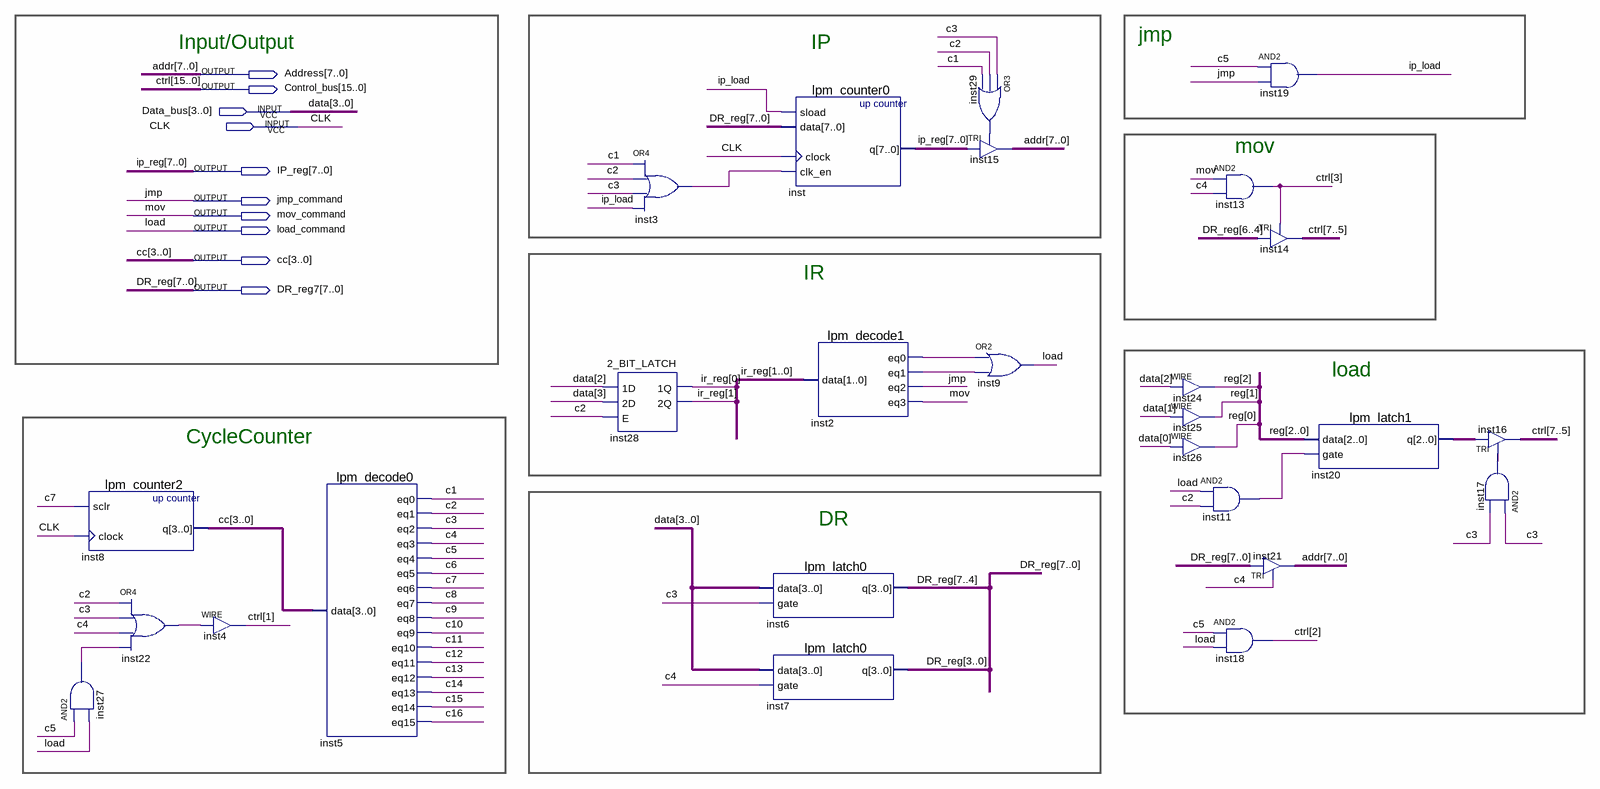
[diagram p0: schematic sheet]
// Quartus schematic _CU.bdf as structural Verilog: 26 symbols, 10 pins
module _CU (
  input  [3:0] Data_bus,
  input  CLK,
  output [7:0] Address,
  output [15:0] Control_bus,
  output [7:0] IP_reg,
  output jmp_command,
  output mov_command,
  output load_command,
  output [3:0] cc,
  output [7:0] DR_reg7
);

  wire c1, c2, c3, c4, c5, c6, c7, c8, c9, c10, c11, c12, c13, c14, c15, c16, inst2_eq0, inst2_eq1,
       inst3_out, inst11_out, inst17_out, inst22_out, inst27_out, inst29_out, ip_load;
  wire [1:0] ir_reg;
  wire [2:0] inst20_q, \reg ;

  lpm_counter2 inst8 (.sclr(c7), .clock(CLK), .q(cc));
  and inst27 (inst27_out, c5, load_command);
  or inst22 (inst22_out, c2, c3, c4, inst27_out);
  assign Control_bus[1] = inst22_out;  // WIRE inst4
  lpm_decode0 inst5 (
    .data(cc), .eq0(c1), .eq1(c2), .eq2(c3), .eq3(c4), .eq4(c5), .eq5(c6), .eq6(c7), .eq7(c8), .eq8(c9),
    .eq9(c10), .eq10(c11), .eq11(c12), .eq12(c13), .eq13(c14), .eq14(c15), .eq15(c16));
  \2_BIT_LATCH  inst28 (.\1D (Data_bus[2]), .\2D (Data_bus[3]), .E(c2), .\1Q (ir_reg[0]), .\2Q (ir_reg[1]));
  or inst3 (inst3_out, c1, c2, c3, ip_load);
  lpm_counter0 inst (.sload(ip_load), .data(DR_reg7), .clock(CLK), .clk_en(inst3_out), .q(IP_reg));
  lpm_decode1 inst2 (.data(ir_reg), .eq0(inst2_eq0), .eq1(inst2_eq1), .eq2(jmp_command), .eq3(mov_command));
  lpm_latch0 inst6 (.data(Data_bus), .gate(c3), .q(DR_reg7[7:4]));
  lpm_latch0 inst7 (.data(Data_bus), .gate(c4), .q(DR_reg7[3:0]));
  or inst29 (inst29_out, c3, c2, c1);
  TRI inst15[7:0] (.IN(IP_reg), .OE(inst29_out), .OUT(Address));
  or inst9 (load_command, inst2_eq0, inst2_eq1);
  and inst13 (Control_bus[3], mov_command, c4);
  assign \reg [2] = Data_bus[2];  // WIRE inst24
  assign \reg [1] = Data_bus[1];  // WIRE inst25
  assign \reg [0] = Data_bus[0];  // WIRE inst26
  and inst11 (inst11_out, load_command, c2);
  and inst18 (Control_bus[2], c5, load_command);
  and inst19 (ip_load, c5, jmp_command);
  TRI inst14[2:0] (.IN(DR_reg7[6:4]), .OE(Control_bus[3]), .OUT(Control_bus[7:5]));
  TRI inst21[7:0] (.IN(DR_reg7), .OE(c4), .OUT(Address));
  lpm_latch1 inst20 (.data(\reg ), .gate(inst11_out), .q(inst20_q));
  TRI inst16[2:0] (.IN(inst20_q), .OE(inst17_out), .OUT(Control_bus[7:5]));
  and inst17 (inst17_out, c3, c3);

  // Other names for the same wires on the sheet: addr[7:0] = Address; ctrl[15:0] = Control_bus; data[3:0] = Data_bus;
  //   DR_reg[7:0] = DR_reg7; jmp = jmp_command; load = load_command; mov = mov_command

  // Notes on the sheet:
  //   jmp
  //   Input/Output
  //   IP
  //   mov
  //   IR
  //   load
  //   CycleCounter
  //   DR
endmodule
